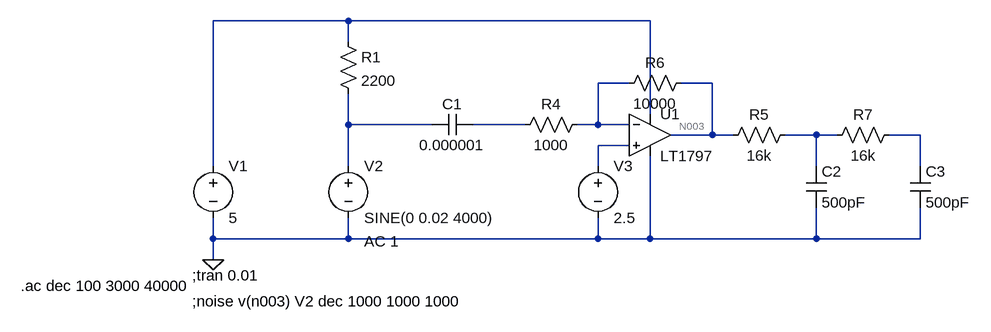
[diagram p0: schematic microphone_planned.asc]
microphone_planned.asc, the LTspice schematic file:
Version 4
SHEET 1 1112 680
WIRE 144 -16 -64 -16
WIRE 608 -16 144 -16
WIRE 144 16 144 -16
WIRE 576 80 528 80
WIRE 704 80 656 80
WIRE 608 128 608 -16
WIRE 144 144 144 96
WIRE 272 144 144 144
WIRE 416 144 336 144
WIRE 528 144 528 80
WIRE 528 144 496 144
WIRE 576 144 528 144
WIRE 704 160 704 80
WIRE 704 160 640 160
WIRE 736 160 704 160
WIRE 864 160 816 160
WIRE 896 160 864 160
WIRE 1024 160 976 160
WIRE 576 176 528 176
WIRE -64 208 -64 -16
WIRE 144 208 144 144
WIRE 528 208 528 176
WIRE 864 208 864 160
WIRE 1024 208 1024 160
WIRE -64 320 -64 288
WIRE 144 320 144 288
WIRE 144 320 -64 320
WIRE 528 320 528 288
WIRE 528 320 144 320
WIRE 608 320 608 192
WIRE 608 320 528 320
WIRE 864 320 864 272
WIRE 864 320 608 320
WIRE 1024 320 1024 272
WIRE 1024 320 864 320
WIRE -64 352 -64 320
FLAG -64 352 0
SYMBOL voltage -64 192 R0
WINDOW 123 0 0 Left 0
WINDOW 39 0 0 Left 0
SYMATTR InstName V1
SYMATTR Value 5
SYMBOL voltage 144 192 R0
WINDOW 123 24 132 Left 0
WINDOW 39 0 0 Left 0
SYMATTR Value2 AC 1
SYMATTR InstName V2
SYMATTR Value SINE(0 0.02 4000)
SYMBOL res 128 0 R0
SYMATTR InstName R1
SYMATTR Value 2200
SYMBOL cap 336 128 R90
WINDOW 0 0 32 VBottom 0
WINDOW 3 32 32 VTop 0
SYMATTR InstName C1
SYMATTR Value 0.000001
SYMBOL Opamps\\LT1797 608 96 R0
SYMATTR InstName U1
SYMBOL res 672 64 R90
WINDOW 0 0 56 VBottom 0
WINDOW 3 32 56 VTop 0
SYMATTR InstName R6
SYMATTR Value 10000
SYMBOL res 512 128 R90
WINDOW 0 0 56 VBottom 0
WINDOW 3 32 56 VTop 0
SYMATTR InstName R4
SYMATTR Value 1000
SYMBOL voltage 528 192 R0
WINDOW 123 0 0 Left 0
WINDOW 39 0 0 Left 0
SYMATTR InstName V3
SYMATTR Value 2.5
SYMBOL res 832 144 R90
WINDOW 0 0 56 VBottom 0
WINDOW 3 32 56 VTop 0
SYMATTR InstName R5
SYMATTR Value 16k
SYMBOL res 992 144 R90
WINDOW 0 0 56 VBottom 0
WINDOW 3 32 56 VTop 0
SYMATTR InstName R7
SYMATTR Value 16k
SYMBOL cap 848 208 R0
SYMATTR InstName C2
SYMATTR Value 500pF
SYMBOL cap 1008 208 R0
SYMATTR InstName C3
SYMATTR Value 500pF
TEXT -96 376 Left 0 !;tran 0.01
TEXT -96 416 Left 0 !;noise v(n003) V2 dec 1000 1000 1000
TEXT -360 392 Left 0 !.ac dec 100 3000 40000

The netlist it stands for:
* microphone_planned.asc
V1 N001 0 5
V2 N004 0 SINE(0 0.02 4000) AC 1
R1 N001 N004 2200
C1 N005 N004 0.000001
XU1 N008 N002 N001 0 N003 LT1797  ; pins In+ In- V+ V- OUT
R6 N003 N002 10000
R4 N002 N005 1000
V3 N008 0 2.5
R5 N006 N003 16k
R7 N007 N006 16k
C2 N006 0 500pF
C3 N007 0 500pF
;tran 0.01
;noise v(n003) V2 dec 1000 1000 1000
.ac dec 100 3000 40000
.backanno
.end